# EAGLE schematic Main Schematic (EAGLE 7.2.0)
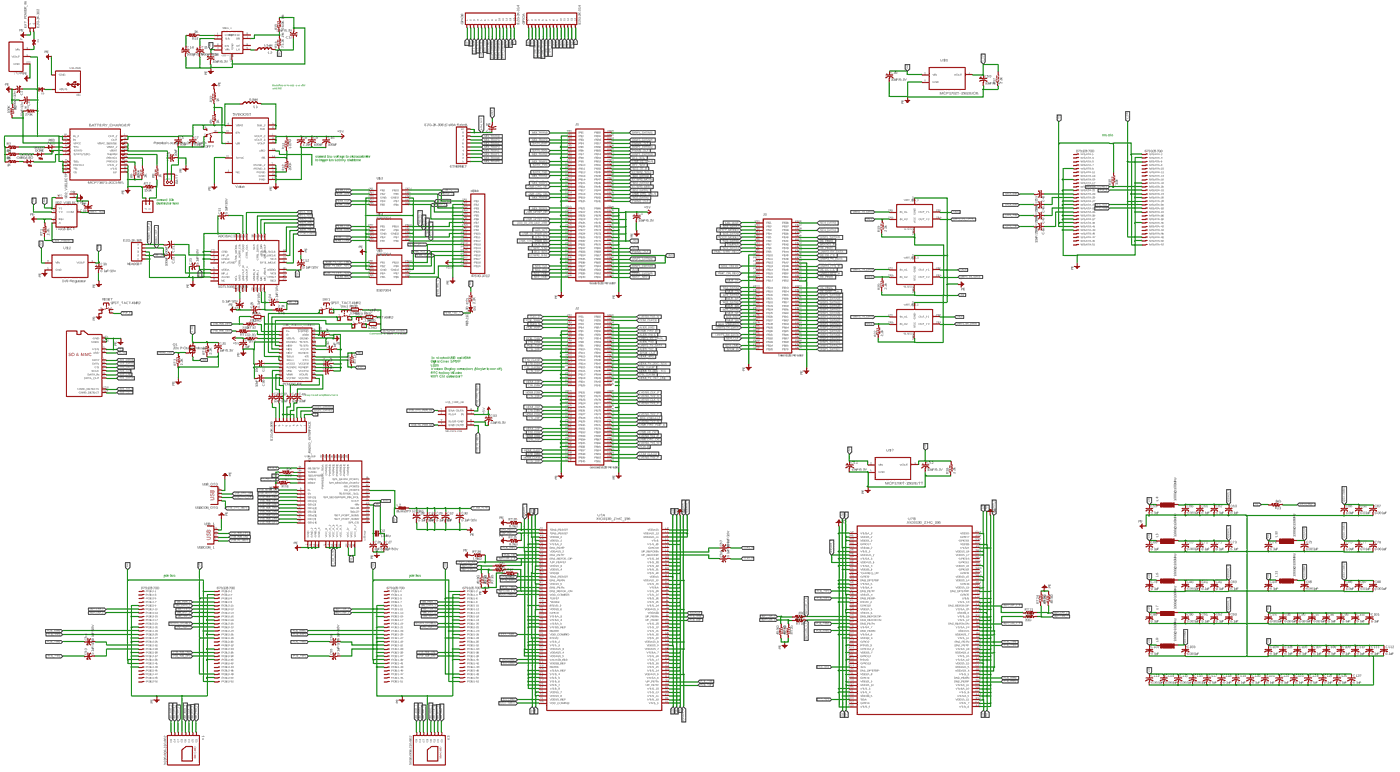
[diagram p0: schematic, sheet 1, overview]
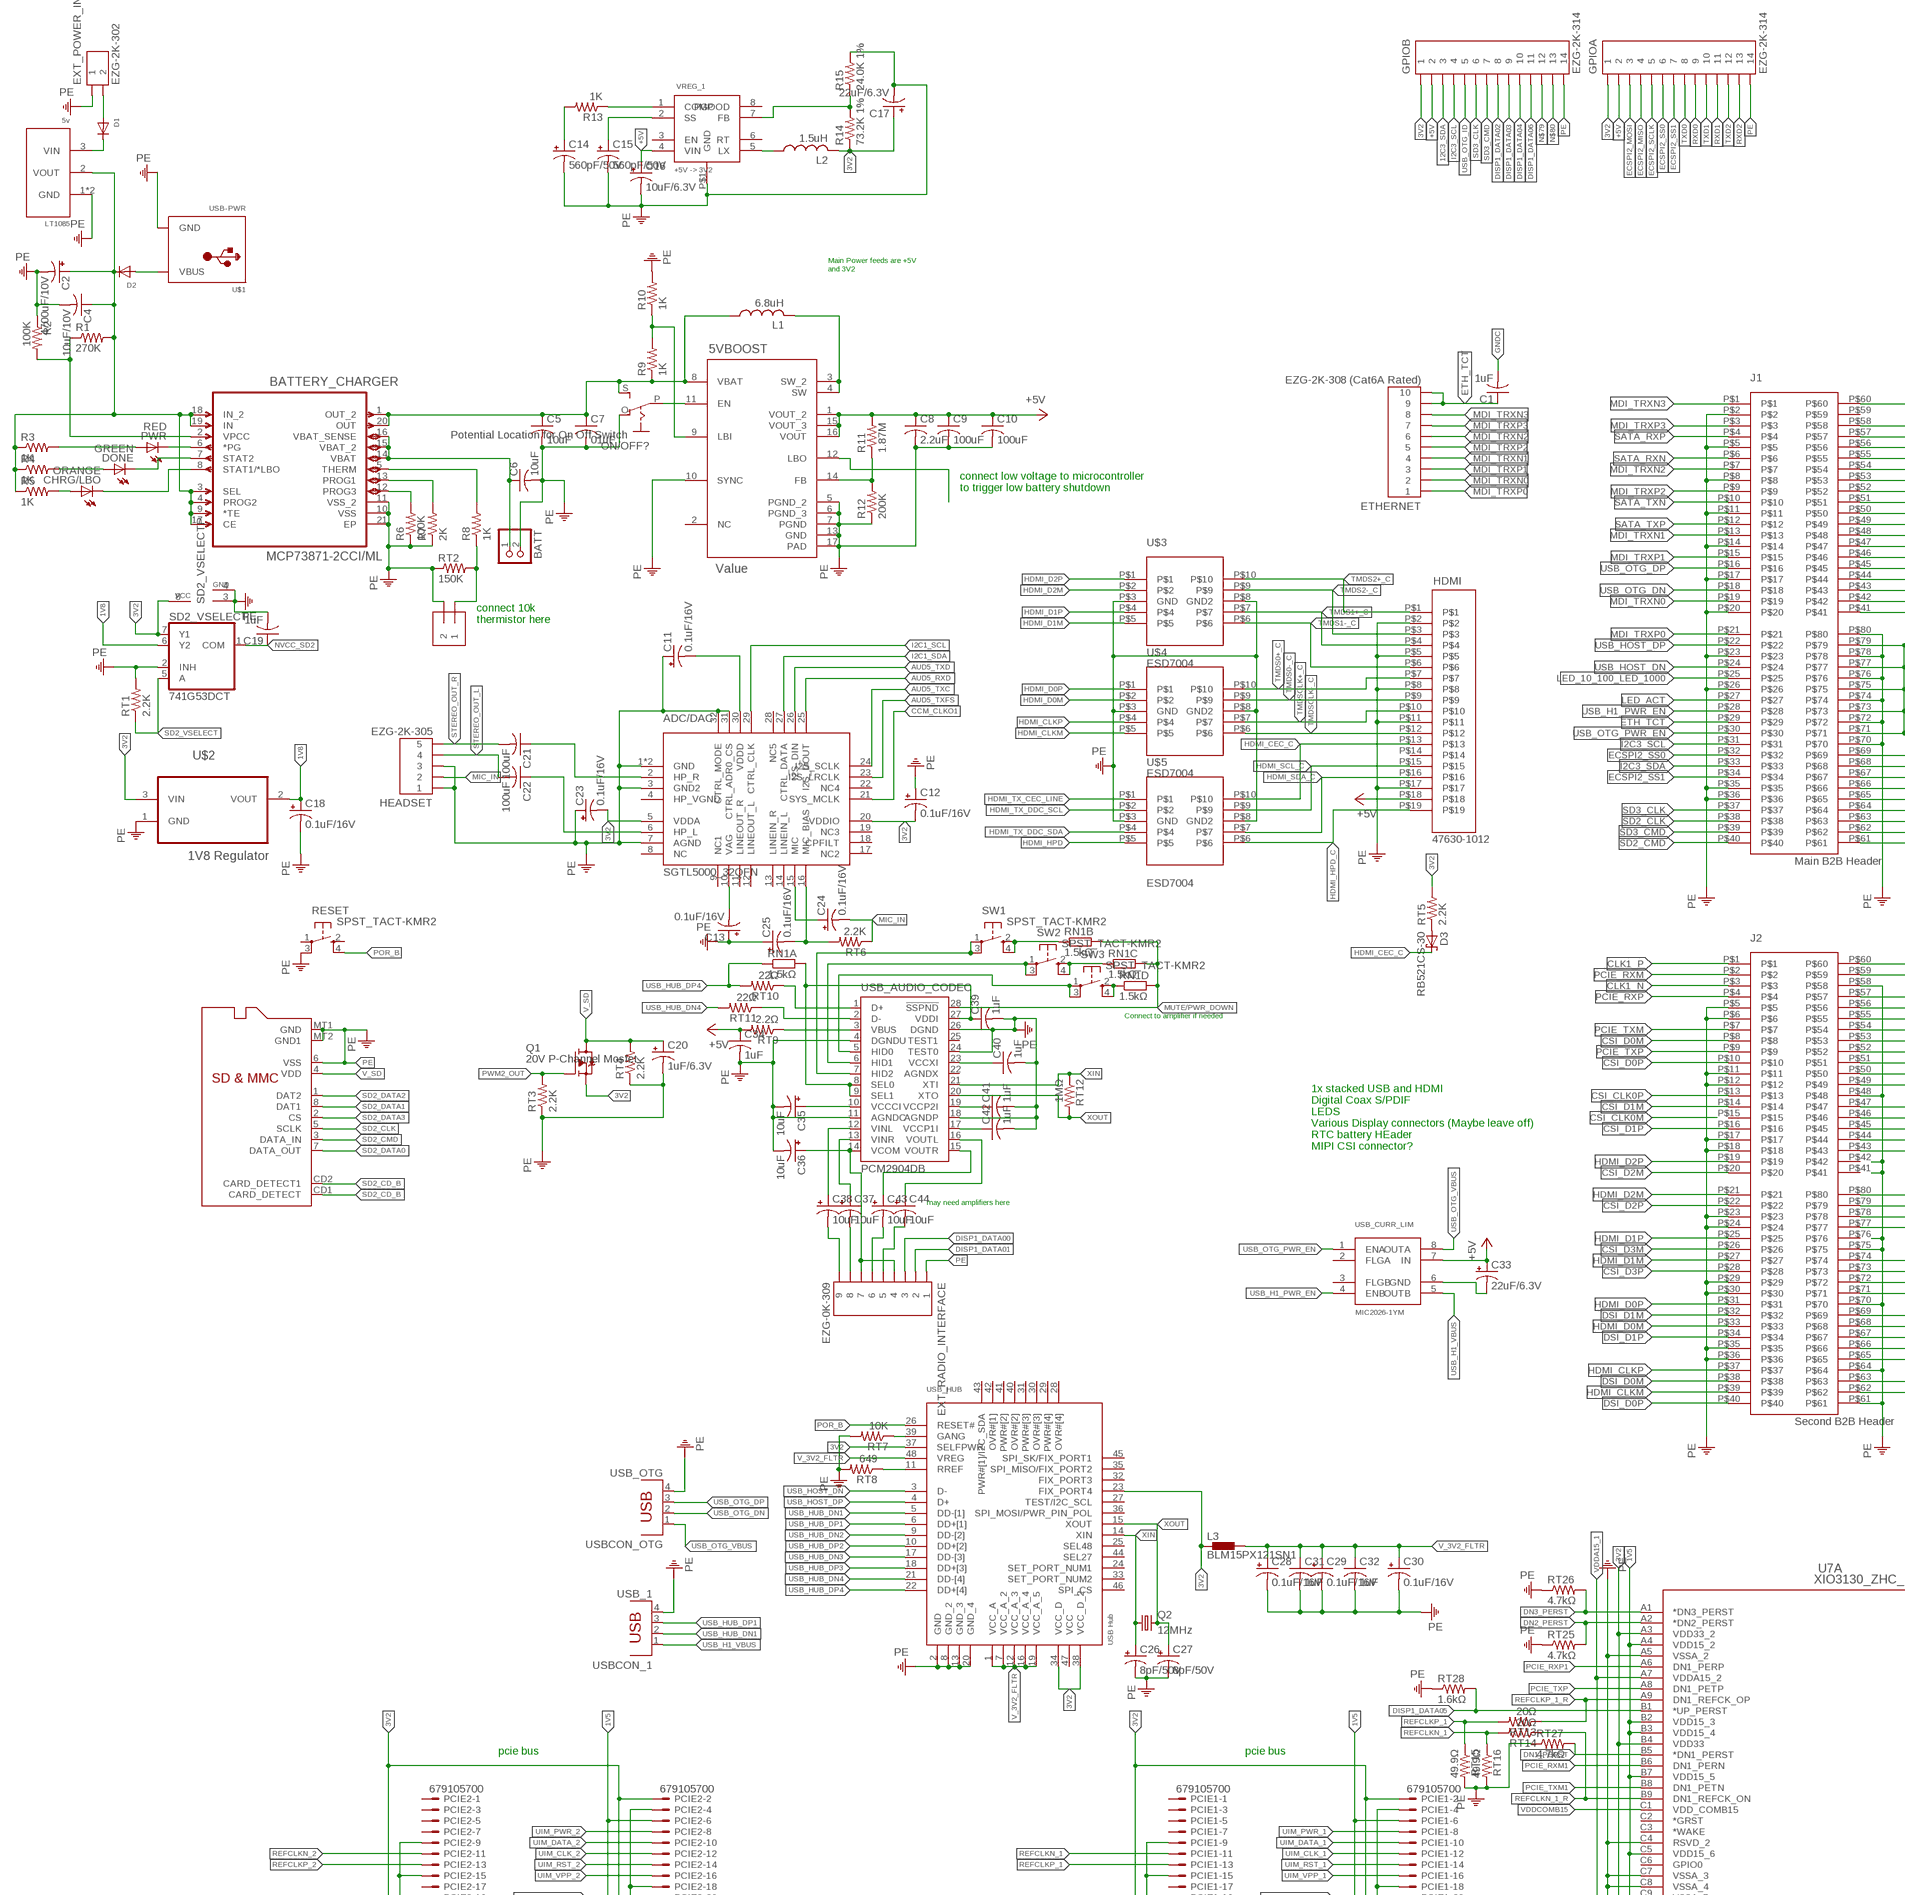
[diagram p1: schematic, sheet 1, part 1 of 5]
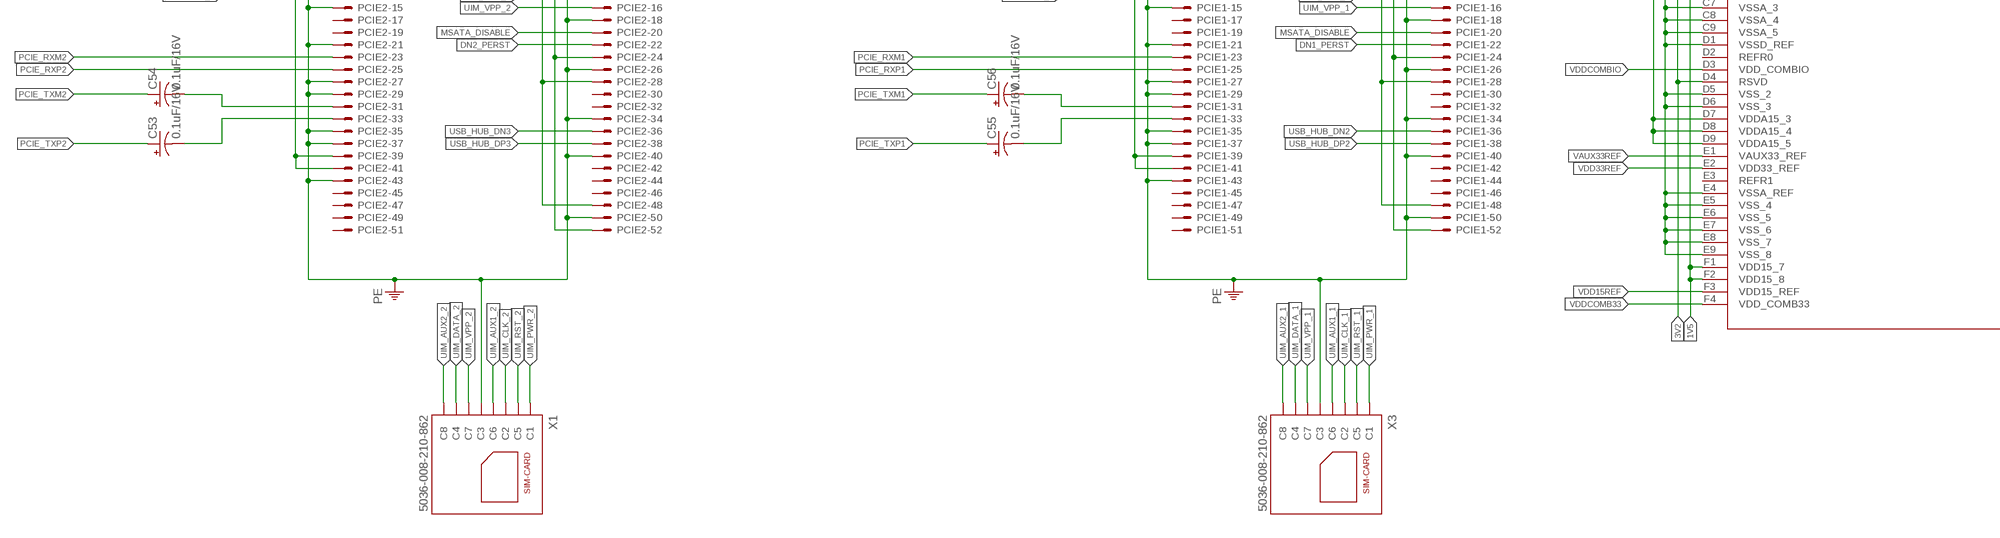
[diagram p2: schematic, sheet 1, part 2 of 5]
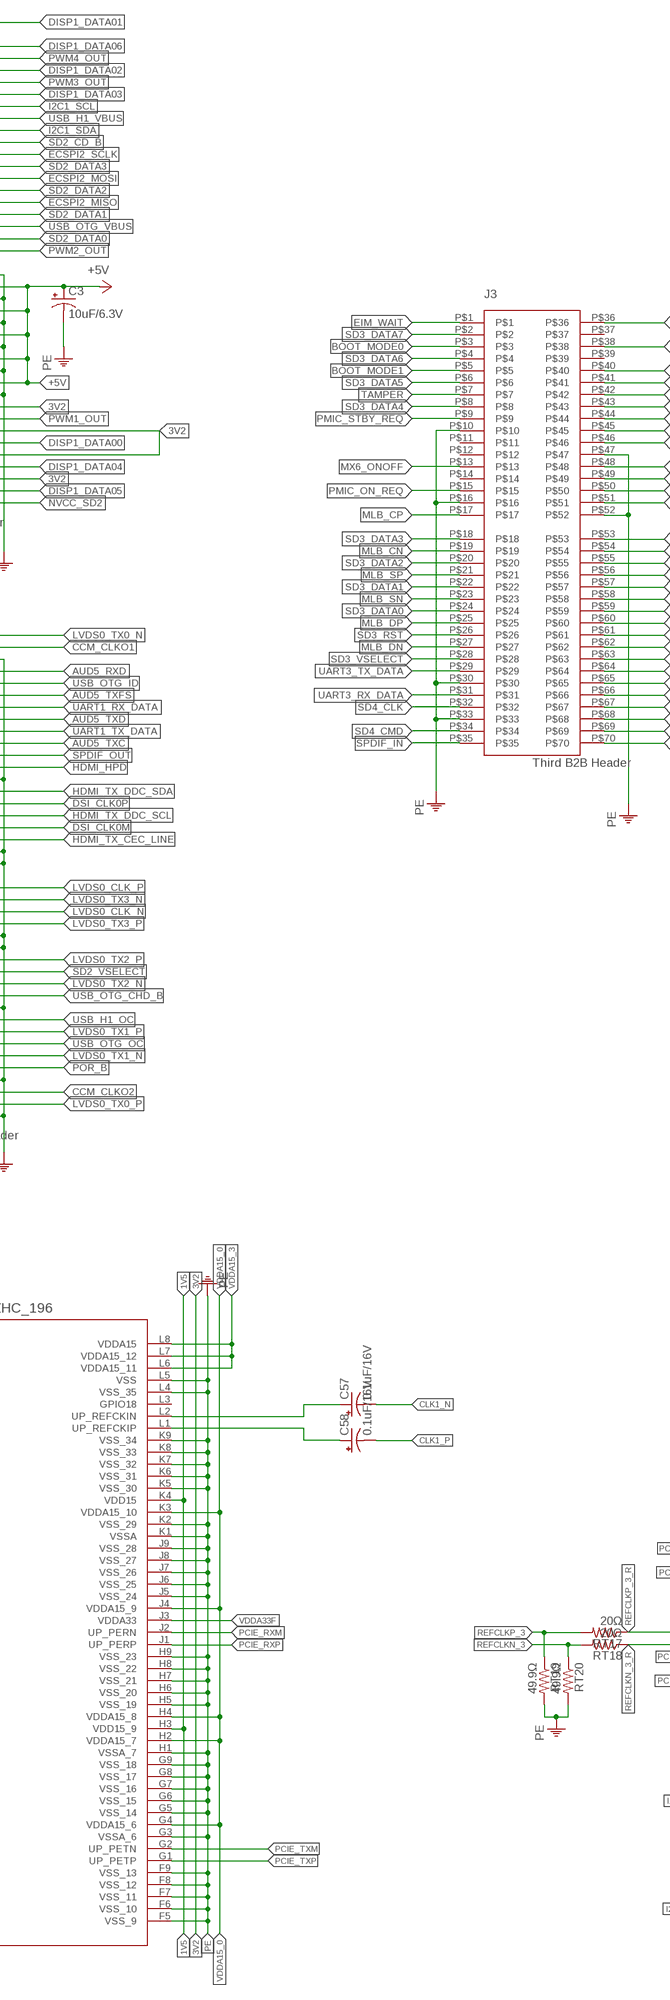
[diagram p3: schematic, sheet 1, part 3 of 5]
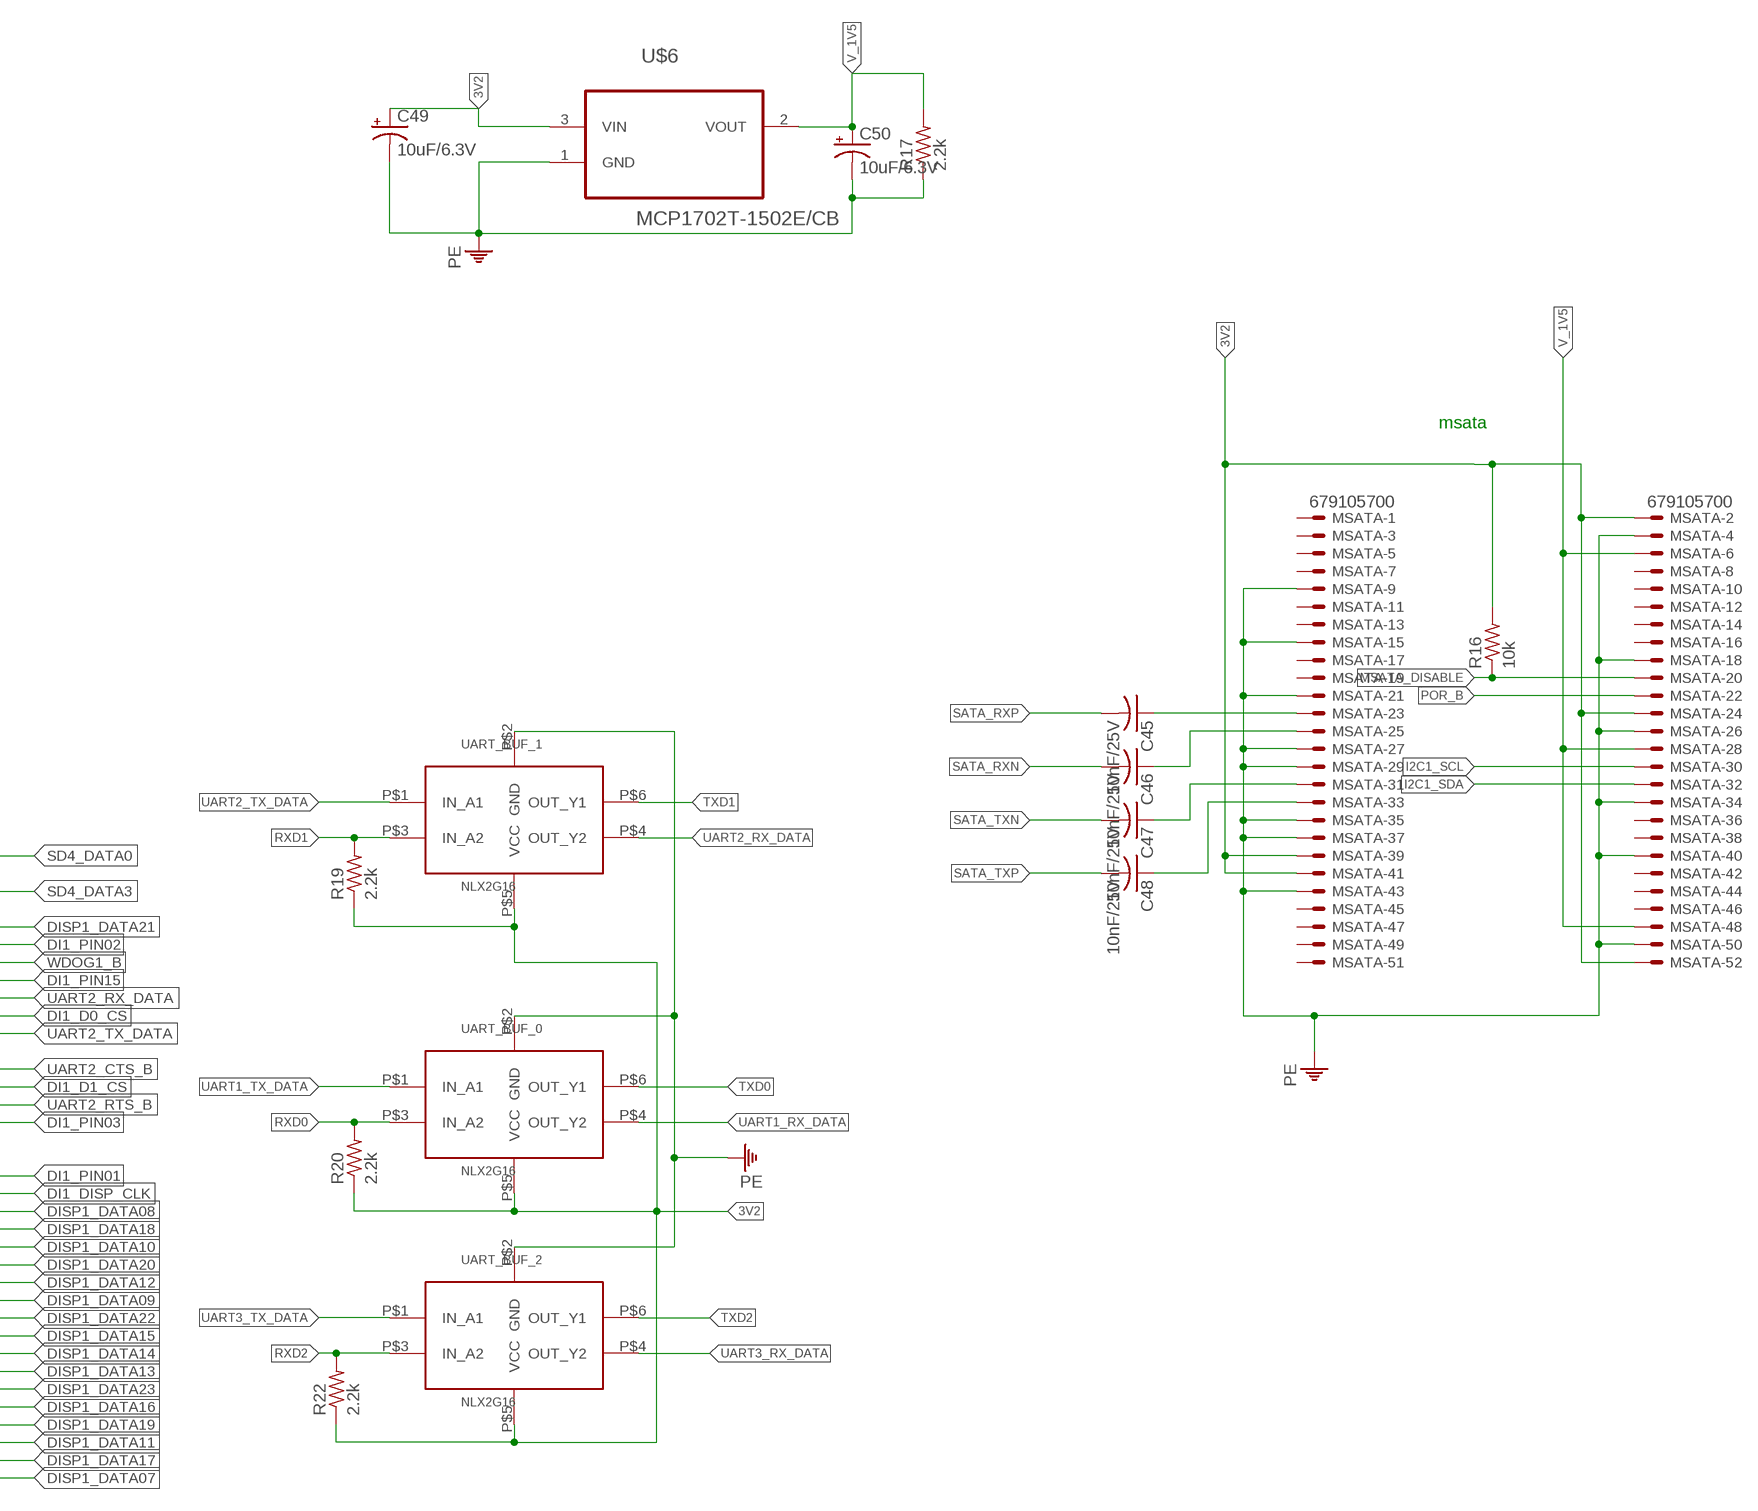
[diagram p4: schematic, sheet 1, part 4 of 5]
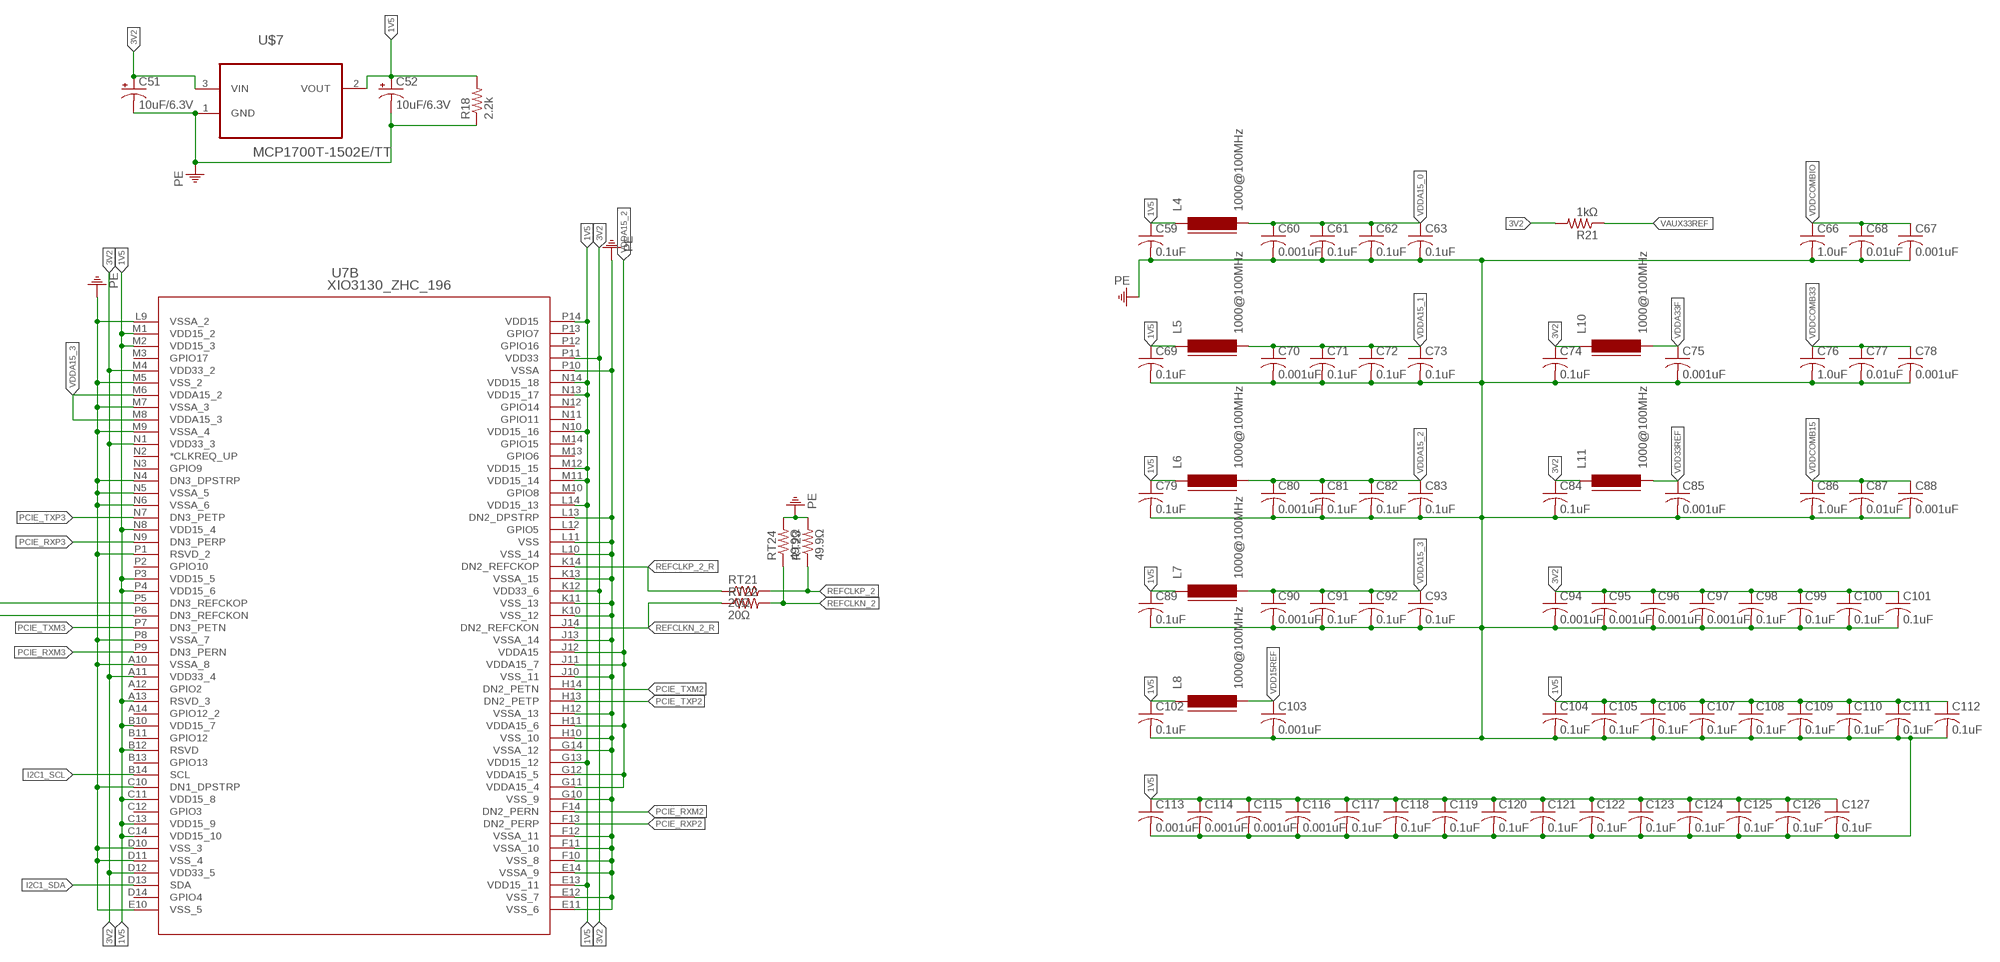
[diagram p5: schematic, sheet 1, part 5 of 5]

## Parts
5VBOOST  Value  TPS61030RSAR  [RSA0016B]
ADC/DAC  SGTL5000_32QFN  SGTL5000  [QFN32]
BATT  JST_2PIN-SMT-RA  [JST-PH-2-SMT-RA]
BATTERY_CHARGER  MCP73871-2CCI/ML  [QFN50P400X400X100-21N]
C1  1uF  C-USC0402  [C0402]
C2  4700uF/10V  CPOL-USR/2012-12R  [R/2012-12R]
C3  10uF/6.3V  CPOL-USR/2012-12R  [R/2012-12R]
C4  10uF/10V  C-USC0402K  [C0402K]
C5  10uF  C-USC0402K  [C0402K]
C6  10uF  C-USC0402K  [C0402K]
C7  01uF  C-USC0402K  [C0402K]
C8  2.2uF  C-USC0402K  [C0402K]
C9  100uF  C-USC0402K  [C0402K]
C10  100uF  C-USC0402K  [C0402K]
C11  0.1uF/16V  CPOL-USR/2012-12R  [R/2012-12R]
C12  0.1uF/16V  CPOL-USR/2012-12R  [R/2012-12R]
C13  0.1uF/16V  CPOL-USR/2012-12R  [R/2012-12R]
C14  560pF/50V  CPOL-USR/2012-12R  [R/2012-12R]
C15  560pF/50V  CPOL-USR/2012-12R  [R/2012-12R]
C16  10uF/6.3V  CPOL-USR/2012-12R  [R/2012-12R]
C17  22uF/6.3V  CPOL-USR/2012-12R  [R/2012-12R]
C18  0.1uF/16V  CPOL-USR/2012-12R  [R/2012-12R]
C19  1uF  C-USC0402K  [C0402K]
C20  1uF/6.3V  CPOL-USR/2012-12R  [R/2012-12R]
C21  100uF  C-USC0402K  [C0402K]
C22  100uF  C-USC0402K  [C0402K]
C23  0.1uF/16V  CPOL-USR/2012-12R  [R/2012-12R]
C24  0.1uF/16V  CPOL-USR/2012-12R  [R/2012-12R]
C25  0.1uF/16V  CPOL-USR/2012-12R  [R/2012-12R]
C26  8pF/50V  CPOL-USR/2012-12R  [R/2012-12R]
C27  8pF/50V  CPOL-USR/2012-12R  [R/2012-12R]
C28  0.1uF/16V  CPOL-USR/2012-12R  [R/2012-12R]
C29  0.1uF/16V  CPOL-USR/2012-12R  [R/2012-12R]
C30  0.1uF/16V  CPOL-USR/2012-12R  [R/2012-12R]
C31  1uF  C-USC0402K  [C0402K]
C32  1uF  C-USC0402K  [C0402K]
C33  22uF/6.3V  CPOL-USR/2012-12R  [R/2012-12R]
C34  1uF  C-USC0402K  [C0402K]
C35  10uF  CPOL-USR/2012-12R  [R/2012-12R]
C36  10uF  CPOL-USR/2012-12R  [R/2012-12R]
C37  10uF  CPOL-USR/2012-12R  [R/2012-12R]
C38  10uF  CPOL-USR/2012-12R  [R/2012-12R]
C39  1uF  C-USC0402K  [C0402K]
C40  1uF  C-USC0402K  [C0402K]
C41  1uF  C-USC0402K  [C0402K]
C42  1uF  C-USC0402K  [C0402K]
C43  10uF  CPOL-USR/2012-12R  [R/2012-12R]
C44  10uF  CPOL-USR/2012-12R  [R/2012-12R]
C45  10nF/25V  C-USC0402  [C0402]
C46  10nF/25V  C-USC0402  [C0402]
C47  10nF/25V  C-USC0402  [C0402]
C48  10nF/25V  C-USC0402  [C0402]
C49  10uF/6.3V  CPOL-USR/2012-12R  [R/2012-12R]
C50  10uF/6.3V  CPOL-USR/2012-12R  [R/2012-12R]
C51  10uF/6.3V  CPOL-USR/2012-12R  [R/2012-12R]
C52  10uF/6.3V  CPOL-USR/2012-12R  [R/2012-12R]
C53  0.1uF/16V  CPOL-USR/2012-12R  [R/2012-12R]
C54  0.1uF/16V  CPOL-USR/2012-12R  [R/2012-12R]
C55  0.1uF/16V  CPOL-USR/2012-12R  [R/2012-12R]
C56  0.1uF/16V  CPOL-USR/2012-12R  [R/2012-12R]
C57  0.1uF/16V  CPOL-USR/2012-12R  [R/2012-12R]
C58  0.1uF/16V  CPOL-USR/2012-12R  [R/2012-12R]
C59  0.1uF  C-USC0402  [C0402]
C60  0.001uF  C-USC0402  [C0402]
C61  0.1uF  C-USC0402  [C0402]
C62  0.1uF  C-USC0402  [C0402]
C63  0.1uF  C-USC0402  [C0402]
C66  1.0uF  C-USC0402  [C0402]
C67  0.001uF  C-USC0402  [C0402]
C68  0.01uF  C-USC0402  [C0402]
C69  0.1uF  C-USC0402  [C0402]
C70  0.001uF  C-USC0402  [C0402]
C71  0.1uF  C-USC0402  [C0402]
C72  0.1uF  C-USC0402  [C0402]
C73  0.1uF  C-USC0402  [C0402]
C74  0.1uF  C-USC0402  [C0402]
C75  0.001uF  C-USC0402  [C0402]
C76  1.0uF  C-USC0402  [C0402]
C77  0.01uF  C-USC0402  [C0402]
C78  0.001uF  C-USC0402  [C0402]
C79  0.1uF  C-USC0402  [C0402]
C80  0.001uF  C-USC0402  [C0402]
C81  0.1uF  C-USC0402  [C0402]
C82  0.1uF  C-USC0402  [C0402]
C83  0.1uF  C-USC0402  [C0402]
C84  0.1uF  C-USC0402  [C0402]
C85  0.001uF  C-USC0402  [C0402]
C86  1.0uF  C-USC0402  [C0402]
C87  0.01uF  C-USC0402  [C0402]
C88  0.001uF  C-USC0402  [C0402]
C89  0.1uF  C-USC0402  [C0402]
C90  0.001uF  C-USC0402  [C0402]
C91  0.1uF  C-USC0402  [C0402]
C92  0.1uF  C-USC0402  [C0402]
C93  0.1uF  C-USC0402  [C0402]
C94  0.001uF  C-USC0402  [C0402]
C95  0.001uF  C-USC0402  [C0402]
C96  0.001uF  C-USC0402  [C0402]
C97  0.001uF  C-USC0402  [C0402]
C98  0.1uF  C-USC0402  [C0402]
C99  0.1uF  C-USC0402  [C0402]
C100  0.1uF  C-USC0402  [C0402]
C101  0.1uF  C-USC0402  [C0402]
C102  0.1uF  C-USC0402  [C0402]
C103  0.001uF  C-USC0402  [C0402]
C104  0.1uF  C-USC0402  [C0402]
C105  0.1uF  C-USC0402  [C0402]
C106  0.1uF  C-USC0402  [C0402]
C107  0.1uF  C-USC0402  [C0402]
C108  0.1uF  C-USC0402  [C0402]
C109  0.1uF  C-USC0402  [C0402]
C110  0.1uF  C-USC0402  [C0402]
C111  0.1uF  C-USC0402  [C0402]
C112  0.1uF  C-USC0402  [C0402]
C113  0.001uF  C-USC0402  [C0402]
C114  0.001uF  C-USC0402  [C0402]
C115  0.001uF  C-USC0402  [C0402]
C116  0.001uF  C-USC0402  [C0402]
C117  0.1uF  C-USC0402  [C0402]
C118  0.1uF  C-USC0402  [C0402]
C119  0.1uF  C-USC0402  [C0402]
C120  0.1uF  C-USC0402  [C0402]
C121  0.1uF  C-USC0402  [C0402]
C122  0.1uF  C-USC0402  [C0402]
C123  0.1uF  C-USC0402  [C0402]
C124  0.1uF  C-USC0402  [C0402]
C125  0.1uF  C-USC0402  [C0402]
C126  0.1uF  C-USC0402  [C0402]
C127  0.1uF  C-USC0402  [C0402]
CHRG/LBO  ORANGE  LEDCHIP-LED0603  [CHIP-LED0603]
D1  DIODESOD-123  [SOD-123]
D2  DIODESOD-123  [SOD-123]
D3  RB521CS-30  SCHOTTKY-DIODESMD  [SMB]
DONE  GREEN  LEDCHIP-LED0603  [CHIP-LED0603]
ETHERNET  EZG-2K-308 (Cat6A Rated)  EZG-1K-310  [EZG-1B-1K-310]
EXT_POWER_IN  EZG-2K-302  [EZG-2B-2K-302]
EXT_RADIO_INTERFACE  EZG-0K-309  [EZG-0B-0K-309]
GPIOA  EZG-2K-314  [EZG-2B-2K-314]
GPIOB  EZG-2K-314  [EZG-2B-2K-314]
HDMI  47630-1012  [47630-1012]
HEADSET  EZG-2K-305  [EZG-2B-2K-305]
J1  Main B2B Header  DF40C-()-80DS-0.4V(51)1.5  [DF40C-80DS]
J2  Second B2B Header  DF40C-()-80DS-0.4V(51)1.5  [DF40C-80DS]
J3  Third B2B Header  DF40C-()-70DS-0.4V(51)1.5  [DF40C-70DS]
L1  6.8uH  L-USL2825P  [L2825P]
L2  1.5uH  L-USL2825P  [L2825P]
L3  BLM15PX121SN1  BLM15HB121SN1  [0402]
L4  1000@100MHz  FERRITE-0402  [FB402]
L5  1000@100MHz  FERRITE-0402  [FB402]
L6  1000@100MHz  FERRITE-0402  [FB402]
L7  1000@100MHz  FERRITE-0402  [FB402]
L8  1000@100MHz  FERRITE-0402  [FB402]
L10  1000@100MHz  FERRITE-0402  [FB402]
L11  1000@100MHz  FERRITE-0402  [FB402]
LT1085  5v  LT1085  [DDPAK-3]
MICRO_SD  MICROSD  [MICROSD]
MSATA  679105700  [679105700]
ON/OFF?  Potential Location for On Off Switch  EG1218S  [EG1218]
PCIE1  679105700  [679105700]
PCIE2  679105700  [679105700]
PWR  RED  LEDCHIP-LED0603  [CHIP-LED0603]
Q1  20V P-Channel Mosfet  TRANSISTOR_FET_TSM2301CX  [SOT-23]
Q2  12MHz  CRYSTALCTS406  [CTS406]
R1  270K  R-US_M0805  [M0805]
R2  100K  R-US_M0805  [M0805]
R3  1K  R-US_M0805  [M0805]
R4  1K  R-US_M0805  [M0805]
R5  1K  R-US_M0805  [M0805]
R6  100K  R-US_M0805  [M0805]
R7  2K  R-US_M0805  [M0805]
R8  1K  R-US_M0805  [M0805]
R9  1K  R-US_M0805  [M0805]
R10  1K  R-US_M0805  [M0805]
R11  1.87M  R-US_M0805  [M0805]
R12  200K  R-US_M0805  [M0805]
R13  1K  R-US_M0805  [M0805]
R14  73.2K 1%  R-US_M0805  [M0805]
R15  24.0K 1%  R-US_M0805  [M0805]
R16  10k  R-US_M0805  [M0805]
R17  2.2k  R-US_M0805  [M0805]
R18  2.2k  R-US_M0805  [M0805]
R19  2.2k  R-US_M0805  [M0805]
R20  2.2k  R-US_M0805  [M0805]
R21  1kΩ  R-US_M0805  [M0805]
R22  2.2k  R-US_M0805  [M0805]
RESET  SPST_TACT-KMR2  [KMR2]
RN1  1.5kΩ  RESISTOR_ARRAY_4  [RN8P-4R-CRA06S]
RT1  2.2K  R-US_M0805  [M0805]
RT2  150K  R-US_M0805  [M0805]
RT3  2.2K  R-US_M0805  [M0805]
RT4  2.2K  R-US_M0805  [M0805]
RT5  2.2K  R-US_M0805  [M0805]
RT6  2.2K  R-US_M0805  [M0805]
RT7  10K  R-US_M0805  [M0805]
RT8  649  R-US_M0805  [M0805]
RT9  2.2Ω  R-US_M0805  [M0805]
RT10  22Ω  R-US_M0805  [M0805]
RT11  22Ω  R-US_M0805  [M0805]
RT12  1MΩ  R-US_M0805  [M0805]
RT13  20Ω  R-US_M0805  [M0805]
RT14  20Ω  R-US_M0805  [M0805]
RT15  49.9Ω  R-US_M0805  [M0805]
RT16  49.9Ω  R-US_M0805  [M0805]
RT17  20Ω  R-US_M0805  [M0805]
RT18  20Ω  R-US_M0805  [M0805]
RT19  49.9Ω  R-US_M0805  [M0805]
RT20  49.9Ω  R-US_M0805  [M0805]
RT21  20Ω  R-US_M0805  [M0805]
RT22  20Ω  R-US_M0805  [M0805]
RT23  49.9Ω  R-US_M0805  [M0805]
RT24  49.9Ω  R-US_M0805  [M0805]
RT25  4.7kΩ  R-US_M0805  [M0805]
RT26  4.7kΩ  R-US_M0805  [M0805]
RT27  4.7kΩ  R-US_M0805  [M0805]
RT28  1.6kΩ  R-US_M0805  [M0805]
SD2_VSELECT  741G53DCT  [DCT_R-PDSO-G8]
SW1  SPST_TACT-KMR2  [KMR2]
SW2  SPST_TACT-KMR2  [KMR2]
SW3  SPST_TACT-KMR2  [KMR2]
THERM  1X2-3.5MM  [1X2-3.5MM]
U7  XIO3130_ZHC_196  [ZHC196]
U$1  USB-PWR  [USB-MINIB-THM-MOLEX-PWRONLY]
U$2  1V8 Regulator  MCP1700T-1802E/TT  [SOT95P237X112-3N]
U$3  ESD7004  [UDFN10]
U$4  ESD7004  [UDFN10]
U$5  ESD7004  [UDFN10]
U$6  MCP1702T-1502E/CB  MCP1702T-2502E/CB  [SOT95P255X145-3N]
U$7  MCP1700T-1502E/TT  MCP1700T-1802E/TT  [SOT95P237X112-3N]
UART_BUF_0  NLX2G16  [UDFN6]
UART_BUF_1  NLX2G16  [UDFN6]
UART_BUF_2  NLX2G16  [UDFN6]
USB_AUDIO_CODEC  PCM2904DB  [SSOP28DB]
USB_CURR_LIM  MIC2026-1YM  MIC2026  [SOIC8]
USB_HUB  USB Hub  CY7C65632  [TQFP48_7X7]
USBCON_1  USB_1  PN87520  [PN87520]
USBCON_OTG  USB_OTG  PN87520  [PN87520]
VREG_1  +5V -> 3V2  RT8070SOP-8  [SOP08]
X1  5036-008-210-862  [5036_008_210_862]
X3  5036-008-210-862  [5036_008_210_862]

## Nets
1V5: C52.+ C59.1 C69.1 C79.1 C89.1 C102.1 C104.1 C105.1 C106.1 C107.1 C108.1 C109.1 C110.1 C111.1 C112.1 C113.1 C114.1 C115.1 C116.1 C117.1 C118.1 C119.1 C120.1 C121.1 C122.1 C123.1 C124.1 C125.1 C126.1 C127.1 L4.1 L5.1 L6.1 L7.1 L8.1 PCIE1.6 PCIE1.28 PCIE1.48 PCIE2.6 PCIE2.28 PCIE2.48 R18.2 U7.A4(A:VDD15_2) U7.A13(B:RSVD_3) U7.B2(A:VDD15_3) U7.B3(A:VDD15_4) U7.B7(A:VDD15_5) U7.B10(B:VDD15_7) U7.B12(B:RSVD) U7.C5(A:VDD15_6) U7.C11(B:VDD15_8) U7.C13(B:VDD15_9) U7.C14(B:VDD15_10) U7.E13(B:VDD15_11) U7.F1(A:VDD15_7) U7.F2(A:VDD15_8) U7.G13(B:VDD15_12) U7.H3(A:VDD15_9) U7.K4(A:VDD15) U7.L14(B:VDD15_13) U7.M1(B:VDD15_2) U7.M2(B:VDD15_3) U7.M11(B:VDD15_14) U7.M12(B:VDD15_15) U7.N8(B:VDD15_4) U7.N10(B:VDD15_16) U7.N13(B:VDD15_17) U7.N14(B:VDD15_18) U7.P3(B:VDD15_5) U7.P4(B:VDD15_6) U7.P14(B:VDD15) U$7.2(VOUT)
1V8: C18.+ SD2_VSELECT.6(Y2) U$2.2(VOUT)
3V2: ADC/DAC.5(VDDA) ADC/DAC.20(VDDIO) C12.- C17.+ C23.- C49.+ C51.+ C74.1 C84.1 C94.1 C95.1 C96.1 C97.1 C98.1 C99.1 C100.1 C101.1 GPIOA.1 GPIOB.1 J1.P$63 J1.P$65 J1.P$67 J1.P$69 L2.2 L3.1 L10.1 L11.1 MSATA.2 MSATA.24 MSATA.39 MSATA.41 MSATA.52 PCIE1.2 PCIE1.24 PCIE1.39 PCIE1.41 PCIE1.52 PCIE2.2 PCIE2.24 PCIE2.39 PCIE2.41 PCIE2.52 Q1.2(S) R14.1 R16.2 R19.1 R20.1 R21.2 R22.1 RT5.2 SD2_VSELECT.7(Y1) SD2_VSELECT.8(VCC) U7.A3(A:VDD33_2) U7.A11(B:VDD33_4) U7.B4(A:VDD33) U7.D4(A:RSVD) U7.D12(B:VDD33_5) U7.K12(B:VDD33_6) U7.M4(B:VDD33_2) U7.N1(B:VDD33_3) U7.P11(B:VDD33) U$2.3(VIN) U$6.3(VIN) U$7.3(VIN) UART_BUF_0.P$5(VCC) UART_BUF_1.P$5(VCC) UART_BUF_2.P$5(VCC) USB_HUB.23(FIX_PORT4) USB_HUB.34(VCC_D) USB_HUB.37(SELFPWR) USB_HUB.38(VCC_D_2)
12C3_SDA: GPIOB.3
+5V: 5VBOOST.1(VOUT_2) 5VBOOST.15(VOUT_3) 5VBOOST.16(VOUT) C3.+ C8.1 C9.1 C10.1 C16.+ C33.+ C34.1 GPIOA.2 GPIOB.2 HDMI.P$18 J1.P$71 J1.P$73 J1.P$75 J1.P$77 J1.P$79 R11.2 RT9.2 USB_CURR_LIM.7(IN) VREG_1.4(VIN)
AUD5_RXD: ADC/DAC.25(I2S_DOUT) J2.P$57
AUD5_TXC: ADC/DAC.24(I2S_SCLK) J2.P$51
AUD5_TXD: ADC/DAC.26(I2S_DIN) J2.P$53
AUD5_TXFS: ADC/DAC.23(I2S_LRCLK) J2.P$55
BOOT_MODE0: J3.P$3
BOOT_MODE1: J3.P$5
CCM_CLKO1: ADC/DAC.21(SYS_MCLK) J2.P$59
CCM_CLKO2: J2.P$63
CLK1_N: C57.- J2.P$3
CLK1_P: C58.- J2.P$1
CSI_CLK0P: J2.P$13
CSI_D0M: J2.P$8
CSI_D0P: J2.P$10
CSI_D1M: J2.P$14
CSI_D1P: J2.P$16
CSI_D2M: J2.P$20
CSI_D2P: J2.P$22
CSI_D3M: J2.P$26
CSI_D3P: J2.P$28
DI1_D0_CS: J3.P$45
DI1_D1_CS: J3.P$49
DI1_DISP_CLK: J3.P$54
DI1_PIN01: J3.P$53
DI1_PIN02: J3.P$41
DI1_PIN03: J3.P$51
DI1_PIN15: J3.P$43
DISP1_DATA00: EXT_RADIO_INTERFACE.3 J1.P$66
DISP1_DATA01: EXT_RADIO_INTERFACE.2 J1.P$60
DISP1_DATA02: GPIOB.8 J1.P$56
DISP1_DATA03: GPIOB.9 J1.P$54
DISP1_DATA04: GPIOB.10 J1.P$64
DISP1_DATA05: J1.P$62 RT28.2 U7.B1(A:*UP_PERST)
DISP1_DATA06: GPIOB.11 J1.P$58
DISP1_DATA07: J3.P$70
DISP1_DATA08: J3.P$55
DISP1_DATA09: J3.P$60
DISP1_DATA10: J3.P$57
DISP1_DATA11: J3.P$68
DISP1_DATA12: J3.P$59
DISP1_DATA13: J3.P$64
DISP1_DATA14: J3.P$63
DISP1_DATA15: J3.P$62
DISP1_DATA16: J3.P$66
DISP1_DATA17: J3.P$69
DISP1_DATA18: J3.P$56
DISP1_DATA19: J3.P$67
DISP1_DATA20: J3.P$58
DISP1_DATA21: J3.P$40
DISP1_DATA22: J3.P$61
DISP1_DATA23: J3.P$65
DN1_PERST: PCIE1.22 RT27.2 U7.B5(A:*DN1_PERST)
DN2_PERST: PCIE2.22 RT25.2 U7.A2(A:*DN2_PERST)
DN3_PERST: RT26.2 U7.A1(A:*DN3_PERST)
DSI_CLK0M: J2.P$44
DSI_CLK0P: J2.P$46
DSI_D0M: J2.P$38
DSI_D0P: J2.P$40
DSI_D1M: J2.P$32
DSI_D1P: J2.P$34
ECSPI2_MISO: GPIOA.4 J1.P$45
ECSPI2_MOSI: GPIOA.3 J1.P$47
ECSPI2_SCLK: GPIOA.5 J1.P$49
ECSPI2_SS0: GPIOA.6 J1.P$32
ECSPI2_SS1: GPIOA.7 J1.P$34
EIM_WAIT: J3.P$1
ETH_TCT: C1.1 ETHERNET.9 ETHERNET.10 J1.P$29
GNDC: C1.2
HDMI_CEC_C: D3.C HDMI.P$13 U$5.P$10
HDMI_CLKM: J2.P$39 U$4.P$5
HDMI_CLKP: J2.P$37 U$4.P$4
HDMI_D0M: J2.P$33 U$4.P$2
HDMI_D0P: J2.P$31 U$4.P$1
HDMI_D1M: J2.P$27 U$3.P$5
HDMI_D1P: J2.P$25 U$3.P$4
HDMI_D2M: J2.P$21 U$3.P$2
HDMI_D2P: J2.P$19 U$3.P$1
HDMI_HPD: J2.P$49 U$5.P$5
HDMI_HPD_C: HDMI.P$19 U$5.P$6
HDMI_SCL_C: HDMI.P$15 U$5.P$9
HDMI_SDA_C: HDMI.P$16 U$5.P$7
HDMI_TX_CEC_LINE: J2.P$43 U$5.P$1
HDMI_TX_DDC_SCL: J2.P$45 U$5.P$2
HDMI_TX_DDC_SDA: J2.P$47 U$5.P$4
I2C1_SCL: ADC/DAC.29(CTRL_CLK) J1.P$53 MSATA.30 U7.B14(B:SCL)
I2C1_SDA: ADC/DAC.27(CTRL_DATA) J1.P$51 MSATA.32 U7.D13(B:SDA)
I2C3_SCL: GPIOB.4 J1.P$31
I2C3_SDA: J1.P$33
LED_10_100_LED_1000: J1.P$25
LED_ACT: J1.P$27
LOWVOLTAGE: 5VBOOST.12(LBO)
LVDS0_CLK_N: J2.P$78
LVDS0_CLK_P: J2.P$80
LVDS0_TX0_N: J2.P$60
LVDS0_TX0_P: J2.P$62
LVDS0_TX1_N: J2.P$66
LVDS0_TX1_P: J2.P$68
LVDS0_TX2_N: J2.P$72
LVDS0_TX2_P: J2.P$74
LVDS0_TX3_N: J2.P$79
LVDS0_TX3_P: J2.P$77
MDI_TRXN0: ETHERNET.2 J1.P$19
MDI_TRXN1: ETHERNET.4 J1.P$13
MDI_TRXN2: ETHERNET.6 J1.P$7
MDI_TRXN3: ETHERNET.8 J1.P$1
MDI_TRXP0: ETHERNET.1 J1.P$21
MDI_TRXP1: ETHERNET.3 J1.P$15
MDI_TRXP2: ETHERNET.5 J1.P$9
MDI_TRXP3: ETHERNET.7 J1.P$3
MIC_IN: C24.- HEADSET.2 RT6.1
MLB_CN: J3.P$19
MLB_CP: J3.P$17
MLB_DN: J3.P$27
MLB_DP: J3.P$25
MLB_SN: J3.P$23
MLB_SP: J3.P$21
MSATA_DISABLE: MSATA.20 PCIE1.20 PCIE2.20 R16.1
MUTE/PWR_DOWN: RN1.5 RN1.6 RN1.7 USB_AUDIO_CODEC.28(!SSPND)
MX6_ONOFF: J3.P$13
N$1: D1.A EXT_POWER_IN.2
N$2: D1.C LT1085.3(VIN)
N$3: BATTERY_CHARGER.6(*PG) PWR.C
N$4: D2.A U$1.VBUS
N$5: BATTERY_CHARGER.2(VPCC) R1.1 R2.2
N$6: PWR.A R3.2
N$7: L2.1 VREG_1.5(LX)
N$8: CHRG/LBO.A R5.2
N$9: BATTERY_CHARGER.7(STAT2) DONE.C
N$10: DONE.A R4.2
N$11: BATTERY_CHARGER.8(STAT1/*LBO) CHRG/LBO.C
N$12: BATT.1 BATTERY_CHARGER.14(VBAT) BATTERY_CHARGER.15(VBAT_2) BATTERY_CHARGER.16(VBAT_SENSE) C6.1
N$13: BATTERY_CHARGER.12(PROG3) R6.2
N$14: BATTERY_CHARGER.13(PROG1) R7.2
N$15: 5VBOOST.11(EN) ON/OFF?.P
N$16: BATTERY_CHARGER.5(THERM) R8.2
N$17: R8.1 RT2.2 THERM.1
N$18: ADC/DAC.30(VDDD) C11.-
N$19: R14.2 R15.1 VREG_1.7(FB)
N$20: 5VBOOST.9(LBI) R9.2 R10.1
N$21: ADC/DAC.15(MIC) C24.+
N$22: 5VBOOST.3(SW_2) 5VBOOST.4(SW) L1.2
N$23: 5VBOOST.14(FB) R11.1 R12.2
N$24: ADC/DAC.10(VAG) C13.-
N$25: C15.+ VREG_1.2(SS)
N$26: D3.A RT5.1
N$27: R13.1 VREG_1.1(COMP)
N$28: C14.+ R13.2
N$29: ADC/DAC.2(HP_R) C21.1
N$30: ADC/DAC.6(HP_L) C22.1
N$31: ADC/DAC.16(MIC_BIAS) C25.- RT6.2
N$32: C40.1 USB_AUDIO_CODEC.23(VCCXI)
N$33: C41.1 USB_AUDIO_CODEC.19(VCCP2I)
N$34: RT8.1 USB_HUB.11(RREF)
N$35: RT7.1 USB_HUB.39(GANG)
N$36: RT9.1 USB_AUDIO_CODEC.3(VBUS)
N$37: RT11.1 USB_AUDIO_CODEC.2(D-)
N$38: RT10.1 USB_AUDIO_CODEC.1(D+)
N$39: C33.- USB_CURR_LIM.6(GND)
N$40: C35.+ USB_AUDIO_CODEC.10(VCCCI)
N$41: C36.+ EXT_RADIO_INTERFACE.4 EXT_RADIO_INTERFACE.7 USB_AUDIO_CODEC.14(VCOM)
N$42: C42.1 USB_AUDIO_CODEC.17(VCCP1I)
N$43: C38.+ USB_AUDIO_CODEC.12(VINL)
N$44: C37.+ USB_AUDIO_CODEC.13(VINR)
N$45: C38.- EXT_RADIO_INTERFACE.9
N$46: C37.- EXT_RADIO_INTERFACE.8
N$47: C43.- EXT_RADIO_INTERFACE.6
N$48: C44.- EXT_RADIO_INTERFACE.5
N$49: C43.+ USB_AUDIO_CODEC.15(VOUTR)
N$50: C44.+ USB_AUDIO_CODEC.16(VOUTL)
N$51: C45.1 MSATA.23
N$52: SW3.1(P) SW3.3(P1) USB_AUDIO_CODEC.5(HID0)
N$53: SW2.1(P) SW2.3(P1) USB_AUDIO_CODEC.6(HID1)
N$54: RN1.2 SW1.2(S) SW1.4(S1)
N$55: SW1.1(P) SW1.3(P1) USB_AUDIO_CODEC.7(HID2)
N$56: C39.1 RN1.8 USB_AUDIO_CODEC.8(SEL0) USB_AUDIO_CODEC.9(SEL1) USB_AUDIO_CODEC.27(VDDI)
N$57: RN1.3 SW2.2(S) SW2.4(S1)
N$58: RN1.4 SW3.2(S) SW3.4(S1)
N$59: C46.1 MSATA.25
N$60: C47.1 MSATA.31
N$61: C48.1 MSATA.33
N$62: C54.- PCIE2.31
N$63: C53.- PCIE2.33
N$66: C56.- PCIE1.31
N$67: C55.- PCIE1.33
N$75: C57.+ U7.L2(A:UP_REFCKIN)
N$77: C58.+ U7.L1(A:UP_REFCKIP)
N$79: GPIOB.12
N$80: GPIOB.13
NVCC_SD2: C19.1 J1.P$61 SD2_VSELECT.1(COM)
PCIE_RXM: J2.P$2 U7.J2(A:UP_PERN)
PCIE_RXM1: PCIE1.23 U7.B6(A:DN1_PERN)
PCIE_RXM2: PCIE2.23 U7.F14(B:DN2_PERN)
PCIE_RXM3: U7.P9(B:DN3_PERN)
PCIE_RXP: J2.P$4 U7.J1(A:UP_PERP)
PCIE_RXP1: PCIE1.25 U7.A6(A:DN1_PERP)
PCIE_RXP2: PCIE2.25 U7.F13(B:DN2_PERP)
PCIE_RXP3: U7.N9(B:DN3_PERP)
PCIE_TXM: J2.P$7 U7.G2(A:UP_PETN)
PCIE_TXM1: C56.+ U7.B8(A:DN1_PETN)
PCIE_TXM2: C54.+ U7.H14(B:DN2_PETN)
PCIE_TXM3: U7.P7(B:DN3_PETN)
PCIE_TXP: J2.P$9 U7.A8(A:DN1_PETP) U7.G1(A:UP_PETP)
PCIE_TXP1: C55.+
PCIE_TXP2: C53.+ U7.H13(B:DN2_PETP)
PCIE_TXP3: U7.N7(B:DN3_PETP)
PE: 5VBOOST.5(PGND_2) 5VBOOST.6(PGND_3) 5VBOOST.7(PGND) 5VBOOST.10(SYNC) 5VBOOST.13(GND) 5VBOOST.17(PAD) ADC/DAC.1(GND) ADC/DAC.3(GND2) ADC/DAC.7(AGND) ADC/DAC.31(CTRL_ADR0_CS) ADC/DAC.32(CTRL_MODE) ADC/DAC.EXP(GND) BATT.2 BATTERY_CHARGER.10(VSS) BATTERY_CHARGER.11(VSS_2) BATTERY_CHARGER.21(EP) C2.- C3.- C4.2 C5.2 C6.2 C7.2 C8.2 C9.2 C10.2 C11.+ C12.+ C13.+ C14.- C15.- C16.- C17.- C18.- C19.2 C20.- C23.+ C25.+ C26.- C27.- C28.- C29.- C30.- C31.2 C32.2 C34.2 C35.- C36.- C39.2 C40.2 C41.2 C42.2 C49.- C50.- C51.- C52.- C59.2 C60.2 C61.2 C62.2 C63.2 C66.2 C67.2 C68.2 C69.2 C70.2 C71.2 C72.2 C73.2 C74.2 C75.2 C76.2 C77.2 C78.2 C79.2 C80.2 C81.2 C82.2 C83.2 C84.2 C85.2 C86.2 C87.2 C88.2 C89.2 C90.2 C91.2 C92.2 C93.2 C94.2 C95.2 C96.2 C97.2 C98.2 C99.2 C100.2 C101.2 C102.2 C103.2 C104.2 C105.2 C106.2 C107.2 C108.2 C109.2 C110.2 C111.2 C112.2 C113.2 C114.2 C115.2 C116.2 C117.2 C118.2 C119.2 C120.2 C121.2 C122.2 C123.2 C124.2 C125.2 C126.2 C127.2 EXT_POWER_IN.1 EXT_RADIO_INTERFACE.1 GPIOA.14 GPIOB.14 HDMI.P$2 HDMI.P$5 HDMI.P$8 HDMI.P$11 HDMI.P$17 HEADSET.1 HEADSET.3 J1.P$2 J1.P$5 J1.P$8 J1.P$11 J1.P$14 J1.P$17 J1.P$20 J1.P$23 J1.P$26 J1.P$35 J1.P$36 J1.P$70 J1.P$72 J1.P$74 J1.P$76 J1.P$78 J1.P$80 J2.P$5 J2.P$6 J2.P$11 J2.P$12 J2.P$17 J2.P$18 J2.P$23 J2.P$24 J2.P$29 J2.P$30 J2.P$35 J2.P$36 J2.P$48 J2.P$58 J2.P$61 J2.P$64 J2.P$70 J2.P$75 J3.P$10 J3.P$16 J3.P$30 J3.P$33 J3.P$47 J3.P$52 LT1085.1(GND) LT1085.THERM(GND) MICRO_SD.6(VSS) MICRO_SD.MT1(GND) MICRO_SD.MT2(GND1) MSATA.4 MSATA.9 MSATA.15 MSATA.18 MSATA.21 MSATA.26 MSATA.27 MSATA.29 MSATA.34 MSATA.35 MSATA.37 MSATA.40 MSATA.43 MSATA.50 ON/OFF?.O PCIE1.4 PCIE1.9 PCIE1.15 PCIE1.18 PCIE1.21 PCIE1.26 PCIE1.27 PCIE1.29 PCIE1.34 PCIE1.35 PCIE1.37 PCIE1.40 PCIE1.43 PCIE1.50 PCIE2.4 PCIE2.9 PCIE2.15 PCIE2.18 PCIE2.21 PCIE2.26 PCIE2.27 PCIE2.29 PCIE2.34 PCIE2.35 PCIE2.37 PCIE2.40 PCIE2.43 PCIE2.50 R2.1 R6.1 R7.1 R10.2 R12.1 R15.2 R17.1 R18.1 RESET.3(P1) RT1.2 RT2.1 RT3.1 RT4.1 RT7.2 RT8.2 RT15.2 RT16.2 RT19.2 RT20.2 RT23.2 RT24.2 RT25.1 RT26.1 RT27.1 RT28.1 SD2_VSELECT.2(INH) SD2_VSELECT.3(GND) SD2_VSELECT.4(GND) THERM.2 U7.A5(A:VSSA_2) U7.A10(B:VSSA_8) U7.C4(A:RSVD_2) U7.C7(A:VSSA_3) U7.C8(A:VSSA_4) U7.C9(A:VSSA_5) U7.C10(B:DN1_DPSTRP) U7.D1(A:VSSD_REF) U7.D5(A:VSS_2) U7.D6(A:VSS_3) U7.D10(B:VSS_3) U7.D11(B:VSS_4) U7.E4(A:VSSA_REF) U7.E5(A:VSS_4) U7.E6(A:VSS_5) U7.E7(A:VSS_6) U7.E8(A:VSS_7) U7.E9(A:VSS_8) U7.E10(B:VSS_5) U7.E11(B:VSS_6) U7.E12(B:VSS_7) U7.E14(B:VSSA_9) U7.F5(A:VSS_9) U7.F6(A:VSS_10) U7.F7(A:VSS_11) U7.F8(A:VSS_12) U7.F9(A:VSS_13) U7.F10(B:VSS_8) U7.F11(B:VSSA_10) U7.F12(B:VSSA_11) U7.G3(A:VSSA_6) U7.G5(A:VSS_14) U7.G6(A:VSS_15) U7.G7(A:VSS_16) U7.G8(A:VSS_17) U7.G9(A:VSS_18) U7.G10(B:VSS_9) U7.G14(B:VSSA_12) U7.H1(A:VSSA_7) U7.H5(A:VSS_19) U7.H6(A:VSS_20) U7.H7(A:VSS_21) U7.H8(A:VSS_22) U7.H9(A:VSS_23) U7.H10(B:VSS_10) U7.H12(B:VSSA_13) U7.J5(A:VSS_24) U7.J6(A:VSS_25) U7.J7(A:VSS_26) U7.J8(A:VSS_27) U7.J9(A:VSS_28) U7.J10(B:VSS_11) U7.J13(B:VSSA_14) U7.K1(A:VSSA) U7.K2(A:VSS_29) U7.K5(A:VSS_30) U7.K6(A:VSS_31) U7.K7(A:VSS_32) U7.K8(A:VSS_33) U7.K9(A:VSS_34) U7.K10(B:VSS_12) U7.K11(B:VSS_13) U7.K13(B:VSSA_15) U7.L4(A:VSS_35) U7.L5(A:VSS) U7.L9(B:VSSA_2) U7.L10(B:VSS_14) U7.L11(B:VSS) U7.L13(B:DN2_DPSTRP) U7.M5(B:VSS_2) U7.M7(B:VSSA_3) U7.M9(B:VSSA_4) U7.N4(B:DN3_DPSTRP) U7.N5(B:VSSA_5) U7.N6(B:VSSA_6) U7.P1(B:RSVD_2) U7.P8(B:VSSA_7) U7.P10(B:VSSA) U$1.GND U$2.1(GND) U$3.P$3(GND) U$3.P$8(GND2) U$4.P$3(GND) U$4.P$8(GND2) U$5.P$3(GND) U$5.P$8(GND2) U$6.1(GND) U$7.1(GND) UART_BUF_0.P$2(GND) UART_BUF_1.P$2(GND) UART_BUF_2.P$2(GND) USB_AUDIO_CODEC.4(DGNDU) USB_AUDIO_CODEC.11(AGNDC) USB_AUDIO_CODEC.18(AGNDP) USB_AUDIO_CODEC.24(TEST0) USB_AUDIO_CODEC.26(DGND) USB_HUB.2(GND) USB_HUB.8(GND_2) USB_HUB.13(GND_3) USB_HUB.20(GND_4) USBCON_1.4 USBCON_OTG.4 VREG_1.P$1(GND) X1.C3 X3.C3
PMIC_ON_REQ: J3.P$15
PMIC_STBY_REQ: J3.P$9
POR_B: J2.P$65 MSATA.22 RESET.4(S1) USB_HUB.26(RESET#)
PWM1_OUT: J1.P$68
PWM2_OUT: J1.P$41 Q1.1(G) RT3.2
PWM3_OUT: J1.P$55
PWM4_OUT: J1.P$57
REFCLKN_1: PCIE1.11 RT14.2 RT16.1
REFCLKN_1_R: RT14.1 U7.B9(A:DN1_REFCK_ON)
REFCLKN_2: PCIE2.11 RT22.2 RT24.1
REFCLKN_2_R: RT22.1 U7.J14(B:DN2_REFCKON)
REFCLKN_3: RT18.2 RT20.1
REFCLKN_3_R: RT18.1 U7.P6(B:DN3_REFCKON)
REFCLKP_1: PCIE1.13 RT13.2 RT15.1
REFCLKP_1_R: RT13.1 U7.A9(A:DN1_REFCK_OP)
REFCLKP_2: PCIE2.13 RT21.2 RT23.1
REFCLKP_2_R: RT21.1 U7.K14(B:DN2_REFCKOP)
REFCLKP_3: RT17.2 RT19.1
REFCLKP_3_R: RT17.1 U7.P5(B:DN3_REFCKOP)
RXD0: GPIOA.9 R20.2 UART_BUF_0.P$3(IN_A2)
RXD1: GPIOA.11 R19.2 UART_BUF_1.P$3(IN_A2)
RXD2: GPIOA.13 R22.2 UART_BUF_2.P$3(IN_A2)
SATA_RXN: C46.2 J1.P$6
SATA_RXP: C45.2 J1.P$4
SATA_TXN: C47.2 J1.P$10
SATA_TXP: C48.2 J1.P$12
SD2_CD_B: J1.P$50 MICRO_SD.CD1(CARD_DETECT) MICRO_SD.CD2(CARD_DETECT1)
SD2_CLK: J1.P$38 MICRO_SD.5(SCLK)
SD2_CMD: J1.P$40 MICRO_SD.3(DATA_IN)
SD2_DATA0: J1.P$42 MICRO_SD.7(DATA_OUT)
SD2_DATA1: J1.P$44 MICRO_SD.8(DAT1)
SD2_DATA2: J1.P$46 MICRO_SD.1(DAT2)
SD2_DATA3: J1.P$48 MICRO_SD.2(CS)
SD2_VSELECT: J2.P$73 RT1.1 SD2_VSELECT.5(A)
SD3_CLK: GPIOB.6 J1.P$37
SD3_CMD: GPIOB.7 J1.P$39
SD3_DATA0: J3.P$24
SD3_DATA1: J3.P$22
SD3_DATA2: J3.P$20
SD3_DATA3: J3.P$18
SD3_DATA4: J3.P$8
SD3_DATA5: J3.P$6
SD3_DATA6: J3.P$4
SD3_DATA7: J3.P$2
SD3_RST: J3.P$26
SD3_VSELECT: J3.P$28
SD4_CLK: J3.P$32
SD4_CMD: J3.P$34
SD4_DATA0: J3.P$36
SD4_DATA3: J3.P$38
SPDIF_IN: J3.P$35
SPDIF_OUT: J2.P$50
STEREO_OUT_L: C22.2 HEADSET.4
STEREO_OUT_R: C21.2 HEADSET.5
TAMPER: J3.P$7
TMDS0+_C: HDMI.P$7 U$4.P$10
TMDS0-_C: HDMI.P$9 U$4.P$9
TMDS1+_C: HDMI.P$4 U$3.P$7
TMDS1-_C: HDMI.P$6 U$3.P$6
TMDS2+_C: HDMI.P$1 U$3.P$10
TMDS2-_C: HDMI.P$3 U$3.P$9
TMDSCLK+_C: HDMI.P$10 U$4.P$7
TMDSCLK-_C: HDMI.P$12 U$4.P$6
TXD0: GPIOA.8 UART_BUF_0.P$6(OUT_Y1)
TXD1: GPIOA.10 UART_BUF_1.P$6(OUT_Y1)
TXD2: GPIOA.12 UART_BUF_2.P$6(OUT_Y1)
UART1_RX_DATA: J2.P$54 UART_BUF_0.P$4(OUT_Y2)
UART1_TX_DATA: J2.P$52 UART_BUF_0.P$1(IN_A1)
UART2_CTS_B: J3.P$48
UART2_RTS_B: J3.P$50
UART2_RX_DATA: J3.P$44 UART_BUF_1.P$4(OUT_Y2)
UART2_TX_DATA: J3.P$46 UART_BUF_1.P$1(IN_A1)
UART3_RX_DATA: J3.P$31 UART_BUF_2.P$4(OUT_Y2)
UART3_TX_DATA: J3.P$29 UART_BUF_2.P$1(IN_A1)
UIM_AUX1_1: X3.C6
UIM_AUX1_2: X1.C6
UIM_AUX2_1: X3.C8
UIM_AUX2_2: X1.C8
UIM_CLK_1: PCIE1.12 X3.C2
UIM_CLK_2: PCIE2.12 X1.C2
UIM_DATA_1: PCIE1.10 X3.C4
UIM_DATA_2: PCIE2.10 X1.C4
UIM_PWR_1: PCIE1.8 X3.C1
UIM_PWR_2: PCIE2.8 X1.C1
UIM_RST_1: PCIE1.14 X3.C5
UIM_RST_2: PCIE2.14 X1.C5
UIM_VPP_1: PCIE1.16 X3.C7
UIM_VPP_2: PCIE2.16 X1.C7
USB_H1_OC: J2.P$69
USB_H1_PWR_EN: J1.P$28 USB_CURR_LIM.4(ENB)
USB_H1_VBUS: J1.P$52 USB_CURR_LIM.5(OUTB) USBCON_1.1
USB_HOST_DN: J1.P$24 USB_HUB.3(D-)
USB_HOST_DP: J1.P$22 USB_HUB.4(D+)
USB_HUB_DN1: USB_HUB.5(DD-[1]) USBCON_1.2
USB_HUB_DN2: PCIE1.36 USB_HUB.9(DD-[2])
USB_HUB_DN3: PCIE2.36 USB_HUB.17(DD-[3])
USB_HUB_DN4: RT11.2 USB_HUB.21(DD-[4])
USB_HUB_DP1: USB_HUB.6(DD+[1]) USBCON_1.3
USB_HUB_DP2: PCIE1.38 USB_HUB.10(DD+[2])
USB_HUB_DP3: PCIE2.38 USB_HUB.18(DD+[3])
USB_HUB_DP4: RN1.1 RT10.2 USB_HUB.22(DD+[4])
USB_OTG_CHD_B: J2.P$71
USB_OTG_DN: J1.P$18 USBCON_OTG.2
USB_OTG_DP: J1.P$16 USBCON_OTG.3
USB_OTG_ID: GPIOB.5 J2.P$56
USB_OTG_OC: J2.P$67
USB_OTG_PWR_EN: J1.P$30 USB_CURR_LIM.1(ENA)
USB_OTG_VBUS: J1.P$43 USB_CURR_LIM.8(OUTA) USBCON_OTG.1
V_1V5: C50.+ MSATA.6 MSATA.28 MSATA.48 R17.2 U$6.2(VOUT)
V_3V2_FLTR: C28.+ C29.+ C30.+ C31.1 C32.1 L3.2 USB_HUB.1(VCC_A) USB_HUB.7(VCC_A_2) USB_HUB.12(VCC_A_3) USB_HUB.16(VCC_A_4) USB_HUB.19(VCC_A_5) USB_HUB.48(VREG)
V_SD: C20.+ MICRO_SD.4(VDD) Q1.3(D) RT4.2
VAUX33REF: R21.1 U7.E1(A:VAUX33_REF)
VBAT: 5VBOOST.8(VBAT) BATTERY_CHARGER.1(OUT_2) BATTERY_CHARGER.20(OUT) C5.1 C7.1 L1.1 ON/OFF?.S R9.1
VDD15REF: C103.1 L8.2 U7.F3(A:VDD15_REF)
VDD33REF: C85.1 L11.2 U7.E2(A:VDD33_REF)
VDDA15_0: C60.1 C61.1 C62.1 C63.1 L4.2 U7.G4(A:VDDA15_6) U7.H2(A:VDDA15_7) U7.H4(A:VDDA15_8) U7.J4(A:VDDA15_9) U7.K3(A:VDDA15_10)
VDDA15_1: C70.1 C71.1 C72.1 C73.1 L5.2 U7.A7(A:VDDA15_2) U7.D7(A:VDDA15_3) U7.D8(A:VDDA15_4) U7.D9(A:VDDA15_5)
VDDA15_2: C80.1 C81.1 C82.1 C83.1 L6.2 U7.G11(B:VDDA15_4) U7.G12(B:VDDA15_5) U7.H11(B:VDDA15_6) U7.J11(B:VDDA15_7) U7.J12(B:VDDA15)
VDDA15_3: C90.1 C91.1 C92.1 C93.1 L7.2 U7.L6(A:VDDA15_11) U7.L7(A:VDDA15_12) U7.L8(A:VDDA15) U7.M6(B:VDDA15_2) U7.M8(B:VDDA15_3)
VDDA33F: C75.1 L10.2 U7.J3(A:VDDA33)
VDDCOMB15: C86.1 C87.1 C88.1 U7.C1(A:VDD_COMB15)
VDDCOMB33: C76.1 C77.1 C78.1 U7.F4(A:VDD_COMB33)
VDDCOMBIO: C66.1 C67.1 C68.1 U7.D3(A:VDD_COMBIO)
VIN+5VBATT: BATTERY_CHARGER.3(SEL) BATTERY_CHARGER.4(PROG2) BATTERY_CHARGER.9(*TE) BATTERY_CHARGER.17(CE) BATTERY_CHARGER.18(IN_2) BATTERY_CHARGER.19(IN) C2.+ C4.1 D2.C LT1085.2(VOUT) R1.2 R3.1 R4.1 R5.1
WDOG1_B: J3.P$42
XIN: C26.+ Q2.1 RT12.1 USB_AUDIO_CODEC.21(XTI) USB_HUB.14(XIN)
XOUT: C27.+ Q2.3 RT12.2 USB_AUDIO_CODEC.20(XTO) USB_HUB.15(XOUT)
Unconnected: 5VBOOST.2(NC) ADC/DAC.4(HP_VGND) ADC/DAC.8(NC) ADC/DAC.9(NC1) ADC/DAC.11(LINEOUT_R) ADC/DAC.12(LINEOUT_L) ADC/DAC.13(LINEIN_R) ADC/DAC.14(LINEIN_L) ADC/DAC.17(NC2) ADC/DAC.18(CPFILT) ADC/DAC.19(NC3) ADC/DAC.22(NC4) ADC/DAC.28(NC5) HDMI.P$14 J1.P$59 J2.P$15 J2.P$41 J2.P$42 J2.P$76 J3.P$11 J3.P$12 J3.P$14 J3.P$37 J3.P$39 MSATA.1 MSATA.3 MSATA.5 MSATA.7 MSATA.8 MSATA.10 MSATA.11 MSATA.12 MSATA.13 MSATA.14 MSATA.16 MSATA.17 MSATA.19 MSATA.36 MSATA.38 MSATA.42 MSATA.44 MSATA.45 MSATA.46 MSATA.47 MSATA.49 MSATA.51 PCIE1.1 PCIE1.3 PCIE1.5 PCIE1.7 PCIE1.17 PCIE1.19 PCIE1.30 PCIE1.32 PCIE1.42 PCIE1.44 PCIE1.45 PCIE1.46 PCIE1.47 PCIE1.49 PCIE1.51 PCIE2.1 PCIE2.3 PCIE2.5 PCIE2.7 PCIE2.17 PCIE2.19 PCIE2.30 PCIE2.32 PCIE2.42 PCIE2.44 PCIE2.45 PCIE2.46 PCIE2.47 PCIE2.49 PCIE2.51 RESET.1(P) RESET.2(S) U7.A12(B:GPIO2) U7.A14(B:GPIO12_2) U7.B11(B:GPIO12) U7.B13(B:GPIO13) U7.C2(A:*GRST) U7.C3(A:*WAKE) U7.C6(A:GPIO0) U7.C12(B:GPIO3) U7.D2(A:REFR0) U7.D14(B:GPIO4) U7.E3(A:REFR1) U7.L3(A:GPIO18) U7.L12(B:GPIO5) U7.M3(B:GPIO17) U7.M10(B:GPIO8) U7.M13(B:GPIO6) U7.M14(B:GPIO15) U7.N2(B:*CLKREQ_UP) U7.N3(B:GPIO9) U7.N11(B:GPIO11) U7.N12(B:GPIO14) U7.P2(B:GPIO10) U7.P12(B:GPIO16) U7.P13(B:GPIO7) USB_AUDIO_CODEC.25(TEST1) USB_CURR_LIM.2(FLGA) USB_CURR_LIM.3(FLGB) USB_HUB.24(SET_PORT_NUM1) USB_HUB.25(SEL48) USB_HUB.27(TEST/I2C_SCL) USB_HUB.28(OVR#[4]) USB_HUB.29(PWR#[4]) USB_HUB.30(OVR#[3]) USB_HUB.31(PWR#[3]) USB_HUB.32(FIX_PORT3) USB_HUB.33(SET_PORT_NUM2) USB_HUB.35(SPI_MISO/FIX_PORT2) USB_HUB.36(SPI_MOSI/PWR_PIN_POL) USB_HUB.40(OVR#[2]) USB_HUB.41(PWR#[2]) USB_HUB.42(OVR#[1]) USB_HUB.43(PWR#[1]/I2C_SDA) USB_HUB.44(SEL27) USB_HUB.45(SPI_SK/FIX_PORT1) USB_HUB.46(SPI_CS) VREG_1.3(EN) VREG_1.6(RT) VREG_1.8(PGOOD)

## Notes on the sheet
- Main Power feeds are +5V 
  and 3V2
- msata
- connect low voltage to microcontroller
  to trigger low battery shutdown
- connect 10k
  thermistor here
- Connect to amplifier if needed
- 1x stacked USB and HDMI
  Digital Coax S/PDIF
  LEDS
  Various Display connectors (Maybe leave off)
  RTC battery HEader
  MIPI CSI connector?
- may need amplifiers here
- pcie bus | pcie bus

## Power pins joined to a net without a drawn wire
AGNDX: USB_AUDIO_CODEC.22(AGNDX)
VCC: USB_HUB.47(VCC)

## Library data of the parts
5VBOOST = texas:TPS61030RSAR: Adjustable, 4-A Switch, 96% Efficient Boost Converter w/20µA Iq The TPS6103x devices provide a power supply solution for products powered by either a one-cell Li-Ion or Li-polymer, or a two to three-cell alkaline, NiCd or NiMH battery. The converter generates a stable output voltage that is either adjusted by an external resistor divider or fixed internally on the chip. It provides high efficient power conversion and is capable of delivering output currents up to 1 A at 5 V at a supply voltage down to 1.8 V. The implemented boost converter is based on a fixed frequency, pulse-width- modulation (PWM) controller using a synchronous rectifier to obtain maximum efficiency. At low load currents the converter enters Power Save mode to maintain a high efficiency over a wide load current range. The Power Save mode can be disabled, forcing the converter to operate at a fixed switching frequency. It can also operate synchronized to an external clock signal that is applied to the SYNC pin. The maximum peak current in the boost switch is limited to a value of 4500 mA. The converter can be disabled to minimize battery drain. During shutdown, the load is completely disconnected from the battery. A low-EMI mode is implemented to reduce ringing and, in effect, lower radiated electromagnetic energy when the converter enters the discontinuous conduction mode. Datasheet <http://www.ti.com/product/TPS61030/datasheet>; COMPTYPE: IC; MANUFACTURER: Texas Instruments; MOUNTTYPE: SMT; PACKAGEREFERENCE: RSA0016B; PARTNUMBER: TPS61030RSAR; PIN_COUNT: 17; REFDES: RefDes; ROHS: Y; TYPE: TYPE
ADC/DAC = freescale:SGTL5000: Low Power Stereo Codec with Headphone Amp Pin 4 - HP_VGND Headphone virtual ground Do not connect HP_VGND to system ground, even when unused. This is a virtual ground (DC voltage) that should never connect to an actual “0 Volt ground”. Use the widest, shortest trace possible for the HP_VGND.; MANUFACTURER: Freescale
BATT = adafruit:JST_2PIN: JST 2-Pin Connectors of various flavors SMT-RA (S2B-PH-SM4) 4UConnector #17311 SMT (B2B-PH-SM4) THM-RA (S2B-PH) THM (B2B-PH)
BATTERY_CHARGER = Microchip_By_element14_Batch_1:MCP73871-2CCI/ML: IC, BATTERY CHARGER, 1A; MPN: MCP73871-2CCI/ML; OC_FARNELL: 1642489; OC_NEWARK: 54M4957; PACKAGE: QFN-20; SUPPLIER: Microchip
C1 C4-C10 C19 C21 C22 C31 C32 C34 C39-C42 C45-C48 = adafruit:C-US: CAPACITOR, American symbol
C2 C3 C11-C18 C20 C23-C30 C33 C35-C38 C43 C44 C49-C58 = adafruit:CPOL-US: POLARIZED CAPACITOR, American symbol
C59-C63 C66-C127 = resistor:C-US: CAPACITOR, American symbol
CHRG/LBO DONE PWR = adafruit:LED: LED OSRAM: - CHIPLED LG R971, LG N971, LY N971, LG Q971, LY Q971, LO R971, LY R971 LH N974, LH R974 LS Q976, LO Q976, LY Q976 LO Q996 - Hyper CHIPLED LW Q18S LB Q993, LB Q99A, LB R99A - SideLED LS A670, LO A670, LY A670, LG A670, LP A670 LB A673, LV A673, LT A673, LW A673 LH A674 LY A675 LS A676, LA A676, LO A676, LY A676, LW A676 LS A679, LY A679, LG A679 - Hyper Micro SIDELED® LS Y876, LA Y876, LO Y876, LY Y876 LT Y87S - SmartLED LW L88C, LW L88S LB L89C, LB L89S, LG L890 LS L89K, LO L89K, LY L89K LS L896, LA L896, LO L896, LY L896 - TOPLED LS T670, LO T670, LY T670, LG T670, LP T670 LSG T670, LSP T670, LSY T670, LOP T670, LYG T670 LG T671, LOG T671, LSG T671 LB T673, LV T673, LT T673, LW T673 LH T674 LS T676, LA T676, LO T676, LY T676, LB T676, LH T676, LSB T676, LW T676 LB T67C, LV T67C, LT T67C, LS T67K, LO T67K, LY T67K, LW E67C LS E67B, LA E67B, LO E67B, LY E67B, LB E67C, LV E67C, LT E67C LW T67C LS T679, LY T679, LG T679 LS T770, LO T770, LY T770, LG T770, LP T770 LB T773, LV T773, LT T773, LW T773 LH T774 LS E675, LA E675, LY E675, LS T675 LS T776, LA T776, LO T776, LY T776, LB T776 LHGB T686 LT T68C, LB T68C - Hyper Mini TOPLED® LB M676 - Mini TOPLED Santana® LG M470 LS M47K, LO M47K, LY M47K Source: http://www.osram.convergy.de/
D1 D2 = adafruit:DIODE: Diode SMADIODE - SMA Surface Mount Package 20V 1A Schottky Diode Digikey: 641-1014-6-ND DO-1N4148 - Through Hole Small Current Diode SOD-123 20V 1 A (.5mV Vf) Schottky Diode - Digikey: MBRX120TPMSCT-ND SOD-323 10V 570mA (.38mV Vf, 3ns) Schottky Diode - Digikey: ZLLS410CT-ND SOD-523 30V 30mA Schottky Diode (RB751S-40TE61) - Digikey: RB751S-40TE61CT-ND SOT23-R/W - SOT23 Package (R = Solder Paste/Reflow Ovens, W = Hand-Soldering) BAT54Film 40V 300mA - Digikey: 497-7162-1-ND
D3 = diode:SCHOTTKY-DIODE: Schottky Diode
ETHERNET = con-lemo:EZG-?-310: LEMO Connector Source: http://www.lemo.com/pdfs/catalog/ROW/German/unipole_multipole.pdf; OC_FARNELL: unknown; OC_NEWARK: unknown
EXT_POWER_IN = con-lemo:EZG-?-302: LEMO Connector Source: http://www.lemo.com/pdfs/catalog/ROW/German/unipole_multipole.pdf; OC_FARNELL: unknown; OC_NEWARK: unknown
EXT_RADIO_INTERFACE = con-lemo:EZG-?-309: LEMO Connector Source: http://www.lemo.com/pdfs/catalog/ROW/German/unipole_multipole.pdf; OC_FARNELL: unknown; OC_NEWARK: unknown
GPIOA GPIOB = con-lemo:EZG-?-314: LEMO Connector Source: http://www.lemo.com/pdfs/catalog/ROW/German/unipole_multipole.pdf; OC_FARNELL: unknown; OC_NEWARK: unknown
HDMI = con-molex:47630-1012: 0.50mm Pitch HDMI* Receptacle, Right Angle Mid-Mount, with Through Hole Solder Tabs,Gold (Au) Flash Plating, Tape and Reel Package, 19 Circuits, Halogen-free, Lead-Free Drawing <http://www.molex.com/pdm_docs/sd/476301012_sd.pdf> Datasheet <http://www.molex.com/elqNow/elqRedir.htm?ref=http://www.molex.com/webdocs/datasheets/pdf/en-us/0476301012_IO_CONNECTORS.pdf>
HEADSET = con-lemo:EZG-?-305: LEMO Connector Source: http://www.lemo.com/pdfs/catalog/ROW/German/unipole_multipole.pdf; OC_FARNELL: unknown; OC_NEWARK: unknown
J1 J2 = Hirose_DF40:DF40C-(**)-80DS-0.4V(51)
J3 = Hirose_DF40:DF40C-(**)-70DS-0.4V(51)
L1 L2 = rcl:L-US: INDUCTOR, American symbol
L3 = inductors:BLM15H: EMIFIL (R) Chip Ferrite Bead for GHz Noise Source: http://www.murata.com/ Ferrite Bead BLM15H.pdf
L4-L8 L10 L11 = dp_devices:FERRITE: Ferrite bead in various packages
LT1085 = linear:LT1085
MICRO_SD = adafruit:MICROSD: Micro-SD / Transflash card holder with SPI pinout For the 3M # 2908-05WB-MG and/or 4UCON #19656 push-push type
MSATA PCIE1 PCIE2 = con-molex:679105700: MINI PCI EXPRESS CONNECTOR 0.8MM PITCH, 52 CIRCUIT Source: http://www.molex.com/pdm_docs/sd/679105700_sd.pdf; MPN: 67910-5700; OC_FARNELL: unknown; OC_NEWARK: 93M2128
ON/OFF? = adafruit:EG1218: SLIDING SWITCH 0.1" spacing through hole, vertical SPDT slide switch http://www.ladyada.net/library/pcb/eaglelibrary.html
Q1 = dp_devices:TRANSISTOR_FET_TSM2301CX: 20V P-Channel Enhancement Mode MOSFET
Q2 = adafruit:CRYSTAL: CRYSTAL; OC_FARNELL: unknown; OC_NEWARK: unknown
R1-R22 RT1-RT28 = adafruit:R-US_: RESISTOR, American symbol
RESET SW1-SW3 = adafruit:SPST_TACT: SMT 6mm switch, EVQQ2 series http://www.ladyada.net/library/eagle
RN1 = dp_devices:RESISTOR_ARRAY_4: 4 Resistor Array 0603
SD2_VSELECT = 74xx-little-us:74*1G53: SINGLE-POLE DOUBLE-THROW (SPDT) ANALOG SWITCH 2:1 ANALOG MULTIPLEXER/DEMULTIPLEXER Source: http://focus.ti.com/lit/ds/symlink/sn74lvc2g53.pdf
THERM = adafruit:1X2: 3.5mm Terminal block http://www.ladyada.net/library/pcb/eaglelibrary.html
U7 = texas:XIO3130_ZHC_196; DATASHEETURL: http://www.ti.com/lit/gpn/XIO3130; DESCRIPTION: x1 PCI Express 4-Port 4-Lane Packet Switch; FAMILY_NAME: PCIE SWITCH; GENERIC_PART_NUMBER: XIO3130; INDUSTRY_STD_PKG_TYPE: BGA MICROSTAR; MANUFACTURER: Texas Instruments; MANUFACTURER_PART_NUMBER: xio3130_zhc_196; PACKAGE_DESIGNATOR: ZHC; PIN_COUNT: 196; VENDOR: Texas Instruments
U$1 = adafruit:USB-PWR
U$2 U$7 = Microchip_By_element14_Batch_1:MCP1700T-1802E/TT: Low Quiescent Current LDO; MPN: MCP1700T-1802E/TT; OC_FARNELL: 1296591; OC_NEWARK: 84R5175; PACKAGE: SOT23-3; SUPPLIER: Microchip
U$3-U$5 = on-semiconductor:ESD7004
U$6 = Microchip_By_element14_Batch_1:MCP1702T-2502E/CB: 250 mA Low Quiescent Current LDO Regulator; MPN: MCP1702T-2502E/CB; OC_FARNELL: 1627173; OC_NEWARK: 09P3987; PACKAGE: SOT23-3; SUPPLIER: Microchip
UART_BUF_0 UART_BUF_1 UART_BUF_2 = on-semiconductor:NLX2G16
USB_AUDIO_CODEC = texas:PCM29*: STEREO AUDIO CODEC WITH USB INTERFACE SINGLE-ENDED ANALOG INPUT/OUTPUT AND S/PDIF; MF: TEXAS INSTRUMENT CONNECTORS; MPN: PCM2904DB; OC_FARNELL: 1207091; OC_NEWARK: 75C5386
USB_CURR_LIM = micrel:MIC2026
USB_HUB = cypress:CY7C65632
USBCON_1 USBCON_OTG = con-berg:PN87520: BERG USB connector; OC_FARNELL: unknown; OC_NEWARK: unknown
VREG_1 = richtek:RT8070
X1 X3 = con-kyocera-elco:5036-008-210-862: SIM Card Module Source: http://www.kyocera-elco.com/prdct/pdf/5036.pdf; OC_FARNELL: unknown; OC_NEWARK: unknown